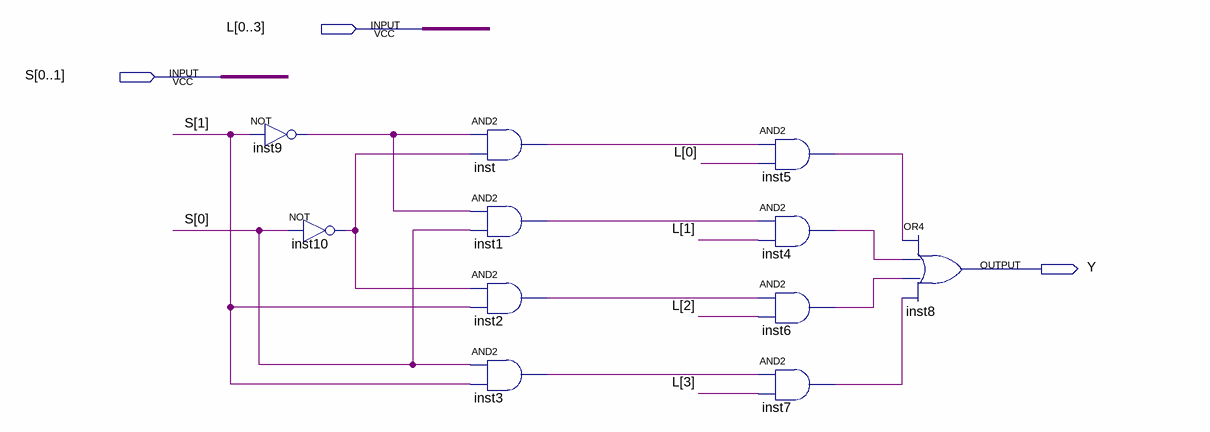
[diagram p0: schematic sheet]
// Quartus schematic 41MUX.bdf as structural Verilog: 11 symbols, 3 pins
module \41MUX  (
  input  [0:3] L,
  input  [0:1] S,
  output Y
);

  wire inst1_out, inst2_out, inst3_out, inst4_out, inst5_out, inst6_out, inst7_out, inst9_out, inst10_out,
       inst_out;

  not inst9 (inst9_out, S[1]);
  not inst10 (inst10_out, S[0]);
  and inst (inst_out, inst9_out, inst10_out);
  and inst1 (inst1_out, inst9_out, S[0]);
  and inst2 (inst2_out, inst10_out, S[1]);
  and inst3 (inst3_out, S[0], S[1]);
  and inst5 (inst5_out, inst_out, L[0]);
  and inst4 (inst4_out, inst1_out, L[1]);
  and inst6 (inst6_out, inst2_out, L[2]);
  and inst7 (inst7_out, inst3_out, L[3]);
  or inst8 (Y, inst5_out, inst4_out, inst6_out, inst7_out);
endmodule
